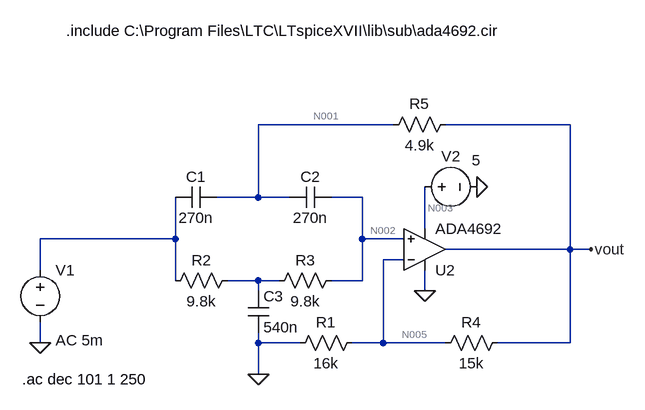
[diagram p0: schematic 60hz_notch_filter.asc]
60hz_notch_filter.asc, the LTspice schematic file:
Version 4
SHEET 1 880 680
WIRE 352 -64 144 -64
WIRE 624 -64 432 -64
WIRE 144 48 144 -64
WIRE 144 48 80 48
WIRE 192 48 144 48
WIRE 304 48 256 48
WIRE 400 96 400 32
WIRE 16 112 16 48
WIRE 16 112 -192 112
WIRE 304 112 304 48
WIRE 368 112 304 112
WIRE 624 128 624 -64
WIRE 624 128 432 128
WIRE 656 128 624 128
WIRE 368 144 336 144
WIRE -192 160 -192 112
WIRE 16 176 16 112
WIRE 144 176 96 176
WIRE 176 176 144 176
WIRE 304 176 304 112
WIRE 304 176 256 176
WIRE 144 192 144 176
WIRE 400 192 400 160
WIRE -192 272 -192 240
WIRE 144 272 144 256
WIRE 208 272 144 272
WIRE 336 272 336 144
WIRE 336 272 288 272
WIRE 432 272 336 272
WIRE 624 272 624 128
WIRE 624 272 512 272
WIRE 144 320 144 272
FLAG -192 272 0
FLAG 656 128 vout
FLAG 144 320 0
FLAG 400 192 0
FLAG 480 32 0
SYMBOL voltage -192 144 R0
WINDOW 123 24 124 Left 2
WINDOW 39 0 0 Left 0
SYMATTR InstName V1
SYMATTR Value ""
SYMATTR Value2 AC 5m
SYMBOL res 112 160 R90
WINDOW 0 0 56 VBottom 2
WINDOW 3 32 56 VTop 2
SYMATTR InstName R2
SYMATTR Value 9.8k
SYMBOL res 272 160 R90
WINDOW 0 0 56 VBottom 2
WINDOW 3 32 56 VTop 2
SYMATTR InstName R3
SYMATTR Value 9.8k
SYMBOL cap 80 32 R90
WINDOW 0 0 32 VBottom 2
WINDOW 3 32 32 VTop 2
SYMATTR InstName C1
SYMATTR Value 270n
SYMBOL cap 256 32 R90
WINDOW 0 0 32 VBottom 2
WINDOW 3 32 32 VTop 2
SYMATTR InstName C2
SYMATTR Value 270n
SYMBOL cap 128 192 R0
SYMATTR InstName C3
SYMATTR Value 540n
SYMBOL res 304 256 R90
WINDOW 0 0 56 VBottom 2
WINDOW 3 32 56 VTop 2
SYMATTR InstName R1
SYMATTR Value 16k
SYMBOL res 528 256 R90
WINDOW 0 0 56 VBottom 2
WINDOW 3 32 56 VTop 2
SYMATTR InstName R4
SYMATTR Value 15k
SYMBOL res 448 -80 R90
WINDOW 0 0 56 VBottom 2
WINDOW 3 32 56 VTop 2
SYMATTR InstName R5
SYMATTR Value 4.9k
SYMBOL Opamps\\opamp2 400 192 M180
SYMATTR InstName U2
SYMATTR Value ADA4692
SYMBOL voltage 384 32 R270
WINDOW 0 32 56 VTop 2
WINDOW 3 57 95 VBottom 2
WINDOW 123 0 0 Left 0
WINDOW 39 0 0 Left 0
SYMATTR InstName V2
SYMATTR Value 5
TEXT -220 328 Left 2 !.ac dec 101 1 250
TEXT -152 -208 Left 2 !.include C:\\Program Files\\LTC\\LTspiceXVII\\lib\\sub\\ada4692.cir

The netlist it stands for:
* 60hz_notch_filter.asc
V1 N004 0 AC 5m
R2 N006 N004 9.8k
R3 N002 N006 9.8k
C1 N001 N004 270n
C2 N002 N001 270n
C3 N006 0 540n
R1 N005 0 16k
R4 vout N005 15k
R5 vout N001 4.9k
XU2 N002 N005 0 N003 vout ADA4692  ; pins In+ In- V+ V- OUT
V2 N003 0 5
.ac dec 101 1 250
.include C:\Program Files\LTC\LTspiceXVII\lib\sub\ada4692.cir
.backanno
.end

* Results of the author's LTspice run, read from the files saved beside the schematic
* Operating Point, zero values left out:
*   V(n002) = -9.8 nV
*   V(n001) = 2.507 V
*   V(n005) = 1.294 V
*   V(vout) = 2.507 V
*   V(n003) = 5 V
*   I(R4) = 80.89 µA
*   I(R1) = 80.89 µA
*   I(V2) = -1.706 A
*   Ix(u2:99) = -1.706 A
*   Ix(u2:50) = 1.706 A
*   Ix(u2:45) = 723.3 µA
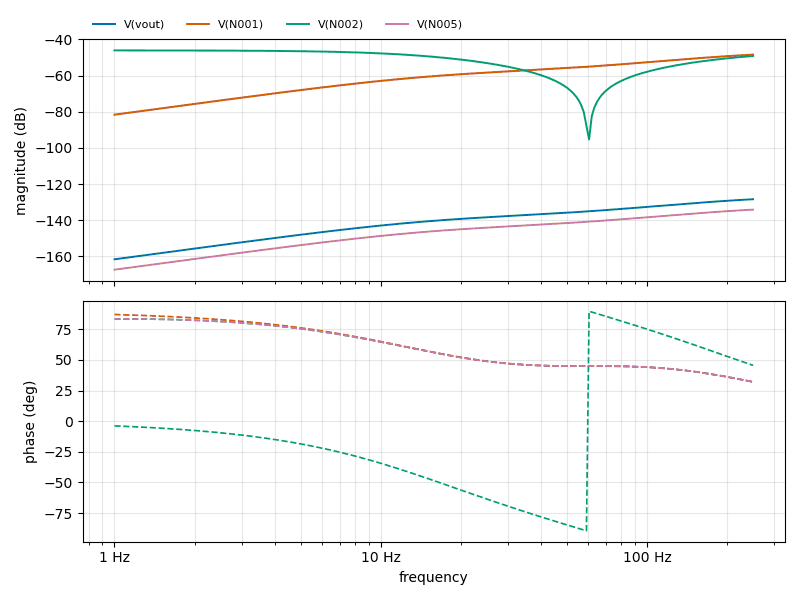
[diagram p1: AC Analysis of 60hz_notch_filter.asc, plotted from the saved traces]
* AC Analysis, 1 run:
*   V(vout): -161.67 dB at 1 Hz, -128.41 dB at 250 Hz, peak -128.41 dB at 250 Hz, 3 dB below the peak at 126.9 Hz
*   V(N001): -81.62 dB at 1 Hz, -48.36 dB at 250 Hz, peak -48.36 dB at 250 Hz, 3 dB below the peak at 126.8 Hz
*   V(N002): -46.04 dB at 1 Hz, -49.12 dB at 250 Hz, peak -46.04 dB at 1 Hz, 3 dB below the peak at 14.25 Hz
*   V(N005): -167.41 dB at 1 Hz, -134.15 dB at 250 Hz, peak -134.15 dB at 250 Hz, 3 dB below the peak at 126.9 Hz